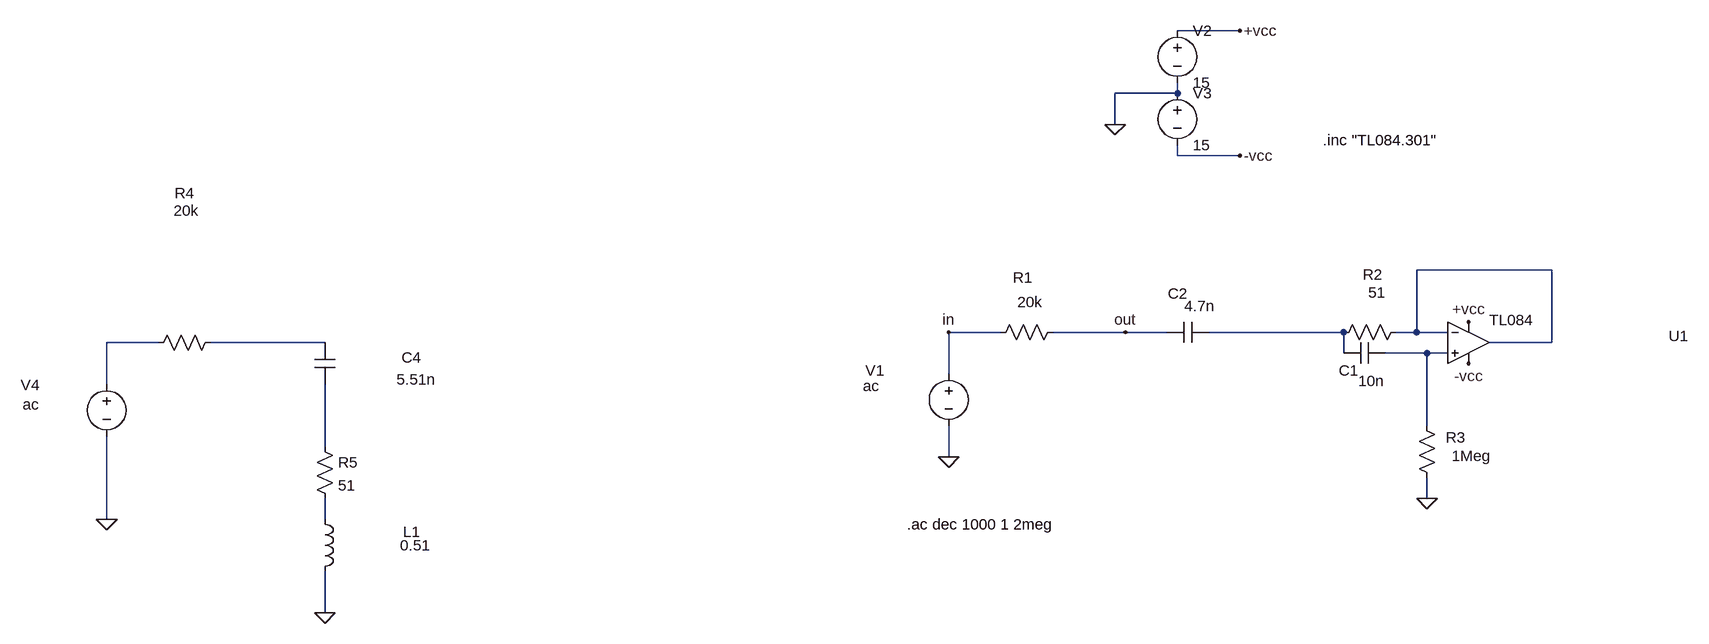
[diagram p0: schematic BR.asc]
BR.asc, the LTspice schematic file:
Version 4
SHEET 1 1512 680
WIRE 816 -368 720 -368
WIRE 720 -272 720 -288
WIRE 720 -272 624 -272
WIRE 624 -224 624 -272
WIRE 720 -176 720 -192
WIRE 816 -176 720 -176
WIRE 1296 0 1088 0
WIRE 448 96 368 96
WIRE 640 96 528 96
WIRE 704 96 640 96
WIRE 976 96 768 96
WIRE 1088 96 1088 0
WIRE 1088 96 1056 96
WIRE 1136 96 1088 96
WIRE -848 112 -928 112
WIRE -592 112 -768 112
WIRE 1296 112 1296 0
WIRE 1296 112 1200 112
WIRE 976 128 976 96
WIRE 1104 128 1040 128
WIRE 1136 128 1104 128
WIRE 368 160 368 96
WIRE -928 176 -928 112
WIRE 1104 240 1104 128
WIRE -592 272 -592 176
WIRE 368 288 368 240
WIRE 1104 352 1104 320
WIRE -928 384 -928 256
WIRE -592 384 -592 352
WIRE -592 528 -592 464
FLAG 368 288 0
FLAG 816 -368 +vcc
FLAG 1168 80 +vcc
FLAG 816 -176 -vcc
FLAG 1168 144 -vcc
FLAG 624 -224 0
FLAG 368 96 in
FLAG 640 96 out
FLAG 1104 352 0
FLAG -928 384 0
FLAG -592 528 0
SYMBOL Opamps\\opamp2 1168 48 R0
WINDOW 0 308 54 Left 2
WINDOW 3 32 29 Left 2
SYMATTR InstName U1
SYMATTR Value TL084
SYMBOL voltage 720 -384 R0
SYMATTR InstName V2
SYMATTR Value 15
SYMBOL voltage 720 -288 R0
SYMATTR InstName V3
SYMATTR Value 15
SYMBOL voltage 368 144 R0
WINDOW 123 0 0 Left 0
WINDOW 39 0 0 Left 0
WINDOW 0 -128 11 Left 2
WINDOW 3 -132 35 Left 2
SYMATTR InstName V1
SYMATTR Value ac
SYMBOL res 544 80 R90
WINDOW 0 -53 62 VBottom 2
WINDOW 3 -46 51 VTop 2
SYMATTR InstName R1
SYMATTR Value 20k
SYMBOL cap 1040 112 R90
WINDOW 0 58 56 VBottom 2
WINDOW 3 43 21 VTop 2
SYMATTR InstName C1
SYMATTR Value 10n
SYMBOL res 1072 80 R90
WINDOW 0 -57 51 VBottom 2
WINDOW 3 -61 45 VTop 2
SYMATTR InstName R2
SYMATTR Value 51
SYMBOL res 1088 224 R0
WINDOW 0 45 34 Left 2
WINDOW 3 54 62 Left 2
SYMATTR InstName R3
SYMATTR Value 1Meg
SYMBOL cap 768 80 R90
WINDOW 0 -28 47 VBottom 2
WINDOW 3 -40 14 VTop 2
SYMATTR InstName C2
SYMATTR Value 4.7n
SYMBOL voltage -928 160 R0
WINDOW 123 0 0 Left 0
WINDOW 39 0 0 Left 0
WINDOW 0 -132 17 Left 2
WINDOW 3 -129 47 Left 2
SYMATTR InstName V4
SYMATTR Value ac
SYMBOL res -752 96 R90
WINDOW 0 -199 56 VBottom 2
WINDOW 3 -203 53 VTop 2
SYMATTR InstName R4
SYMATTR Value 20k
SYMBOL cap -608 112 R0
WINDOW 0 134 23 Left 2
WINDOW 3 126 57 Left 2
SYMATTR InstName C4
SYMATTR Value 5.51n
SYMBOL ind -608 368 R0
WINDOW 0 136 35 Left 2
WINDOW 3 132 56 Left 2
SYMATTR InstName L1
SYMATTR Value 0.51
SYMBOL res -608 256 R0
SYMATTR InstName R5
SYMATTR Value 51
TEXT 304 392 Left 2 !.ac dec 1000 1 2meg
TEXT 944 -200 Left 2 !.inc "TL084.301"

The netlist it stands for:
* BR.asc
XU1 N005 N001 +vcc -vcc N001 TL084  ; pins In+ In- V+ V- OUT
V2 +vcc 0 15
V3 0 -vcc 15
V1 in 0 ac
R1 out in 20k
C1 N005 N002 10n
R2 N001 N002 51
R3 N005 0 1Meg
C2 N002 out 4.7n
V4 N003 0 ac
R4 N004 N003 20k
C4 N004 N006 5.51n
L1 N007 0 0.51
R5 N006 N007 51
.ac dec 1000 1 2meg
.inc "TL084.301"
.backanno
.end